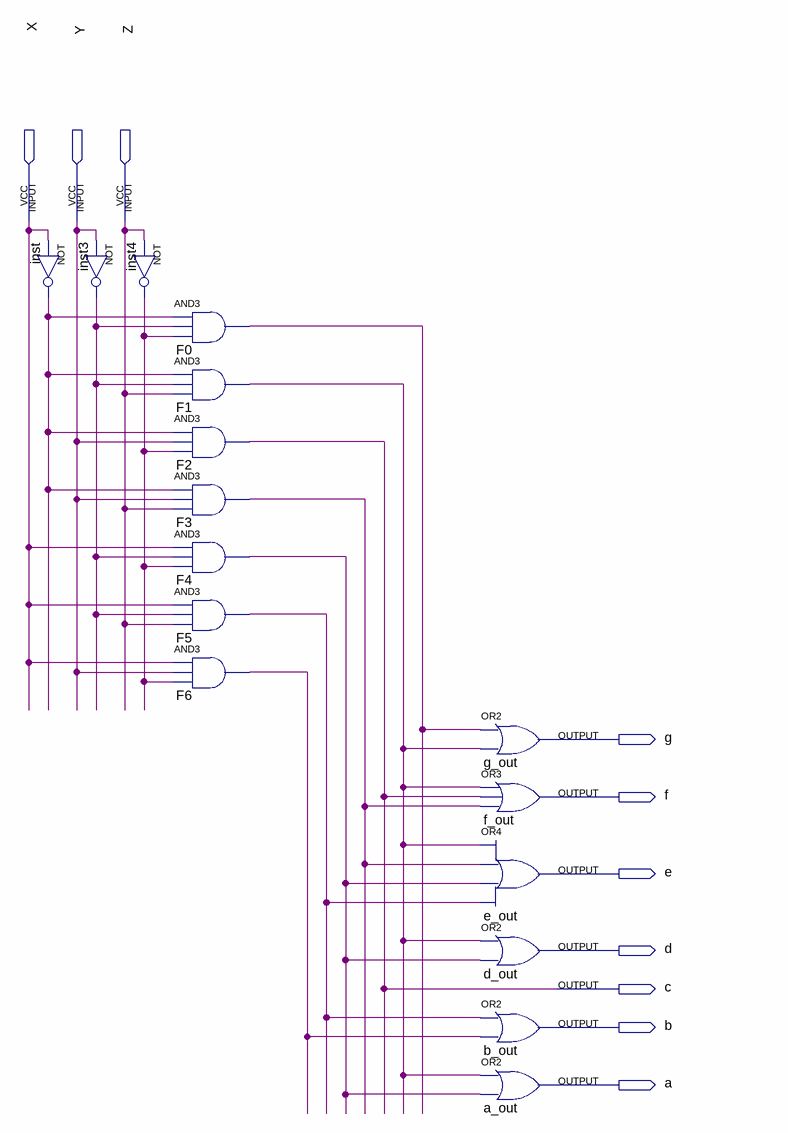
[diagram p0: schematic sheet]
// Quartus schematic DECODER.bdf as structural Verilog: 16 symbols, 10 pins
module DECODER (
  input  X,
  input  Y,
  input  Z,
  output g,
  output f,
  output e,
  output d,
  output c,
  output b,
  output a
);

  wire F0_out, F1_out, F3_out, F4_out, F5_out, F6_out, inst3_out, inst4_out, inst_out;

  not inst (inst_out, X);
  not inst3 (inst3_out, Y);
  not inst4 (inst4_out, Z);
  and F0 (F0_out, inst_out, inst3_out, inst4_out);
  and F1 (F1_out, inst_out, inst3_out, Z);
  and F2 (c, inst_out, Y, inst4_out);
  and F3 (F3_out, inst_out, Y, Z);
  and F4 (F4_out, X, inst3_out, inst4_out);
  and F5 (F5_out, X, inst3_out, Z);
  and F6 (F6_out, X, Y, inst4_out);
  or g_out (g, F0_out, F1_out);
  or f_out (f, F1_out, c, F3_out);
  or e_out (e, F1_out, F3_out, F4_out, F5_out);
  or d_out (d, F1_out, F4_out);
  or b_out (b, F5_out, F6_out);
  or a_out (a, F1_out, F4_out);
endmodule
